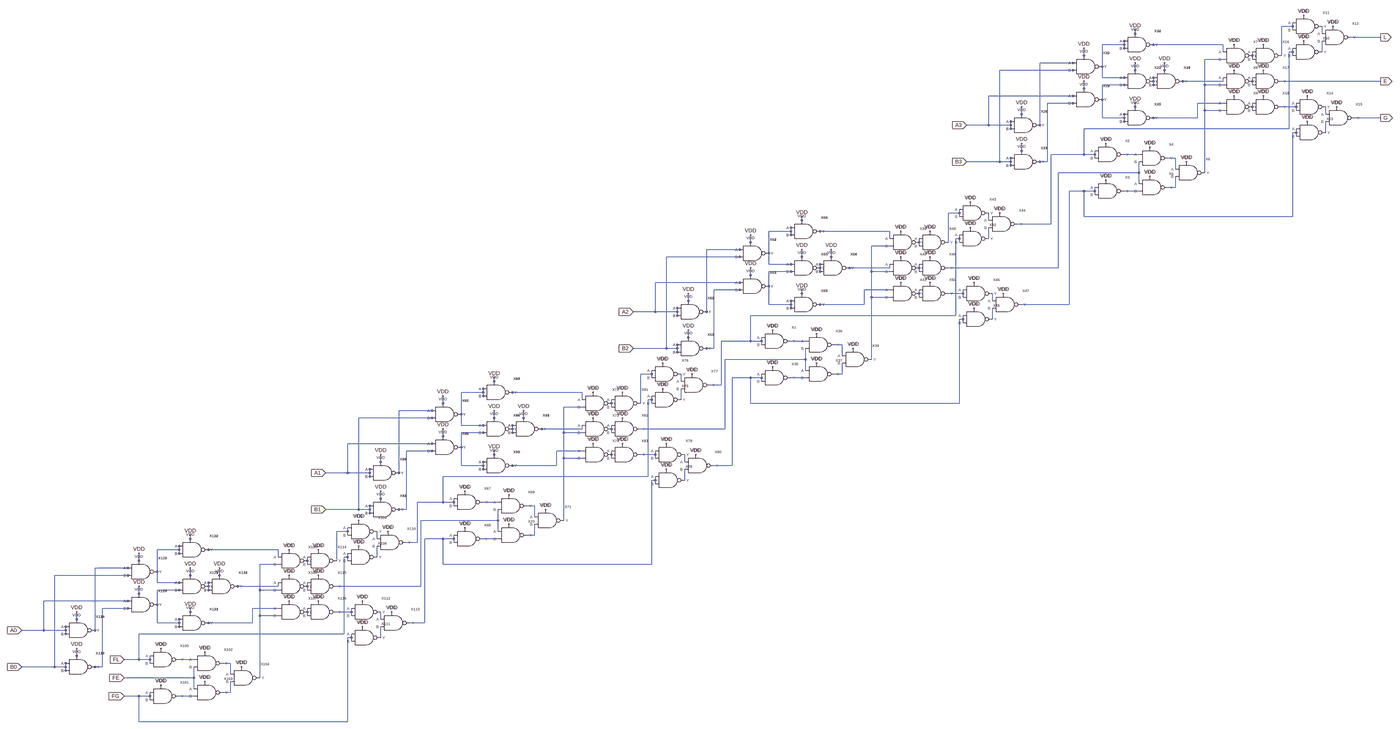
[diagram p0: schematic full-comparator4-all-in-one.asc, whole sheet]
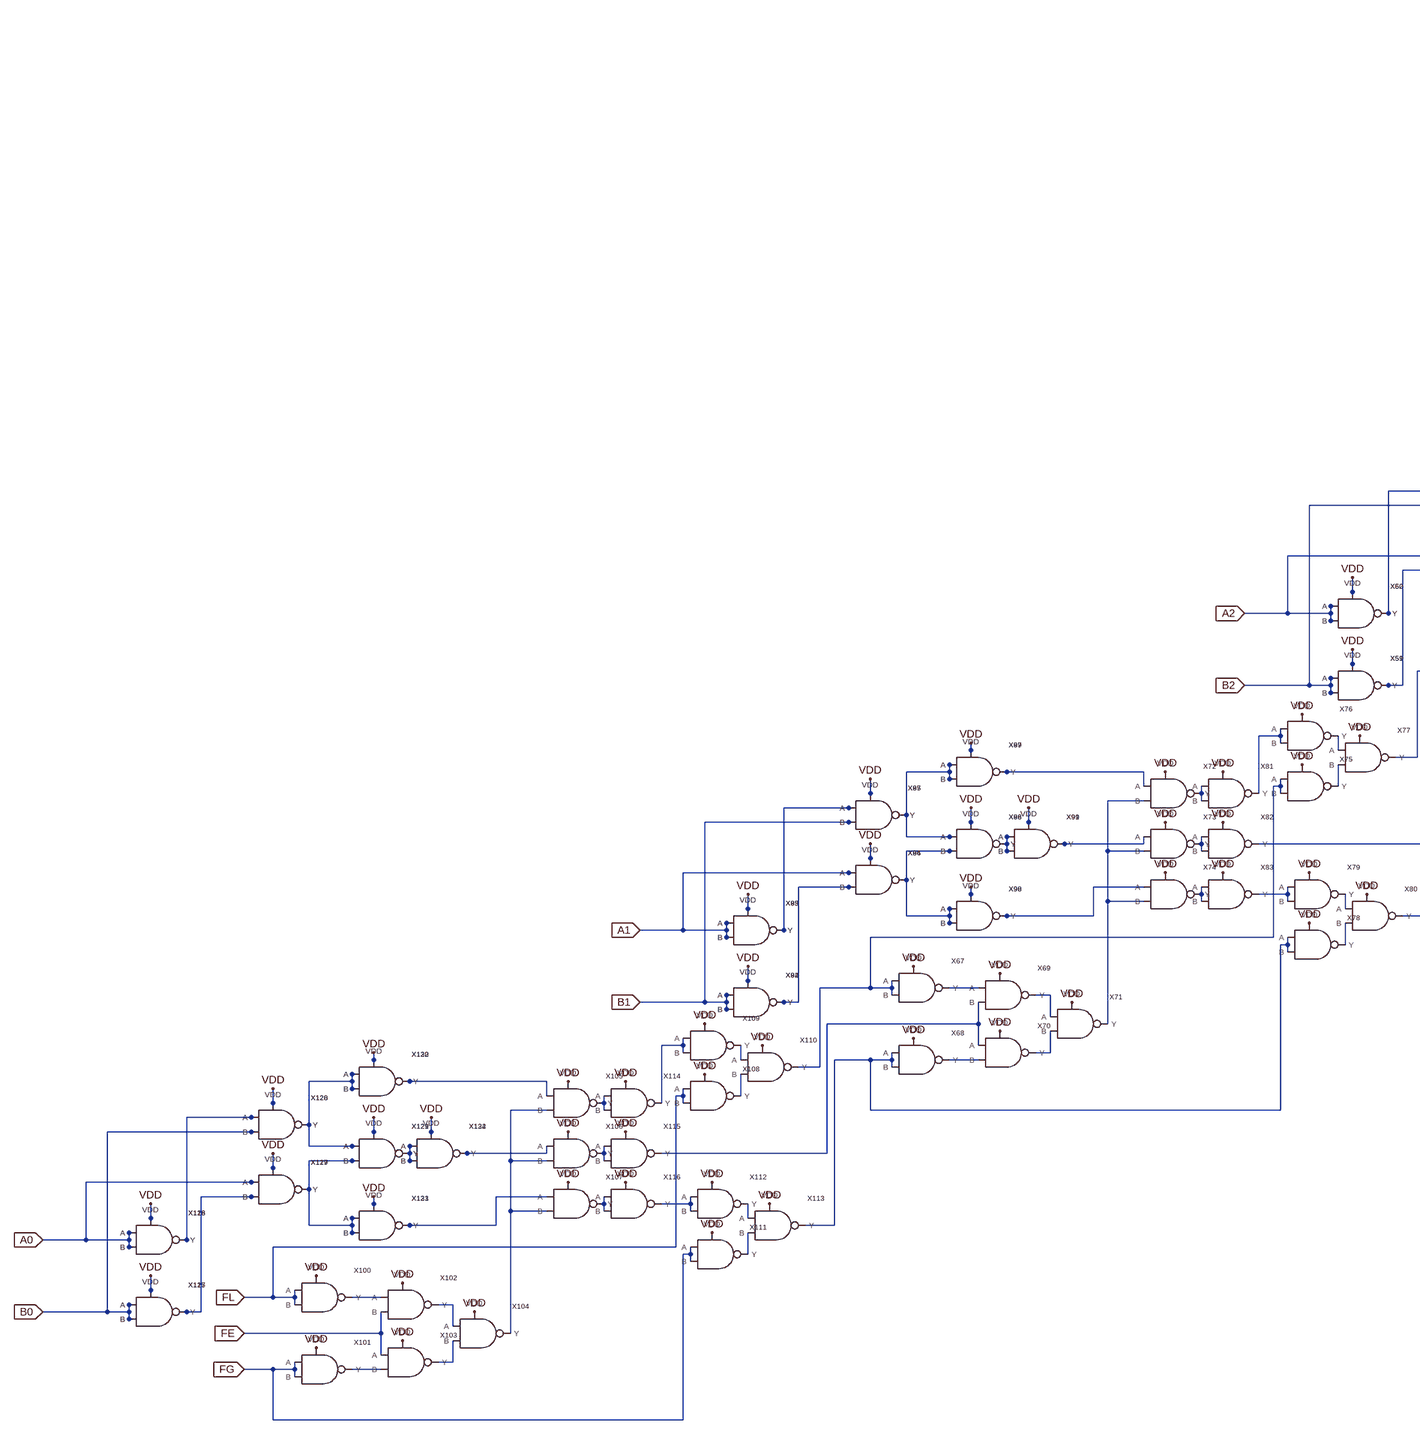
[diagram p1: schematic full-comparator4-all-in-one.asc, part, row 1 of 1, column 1 of 2]
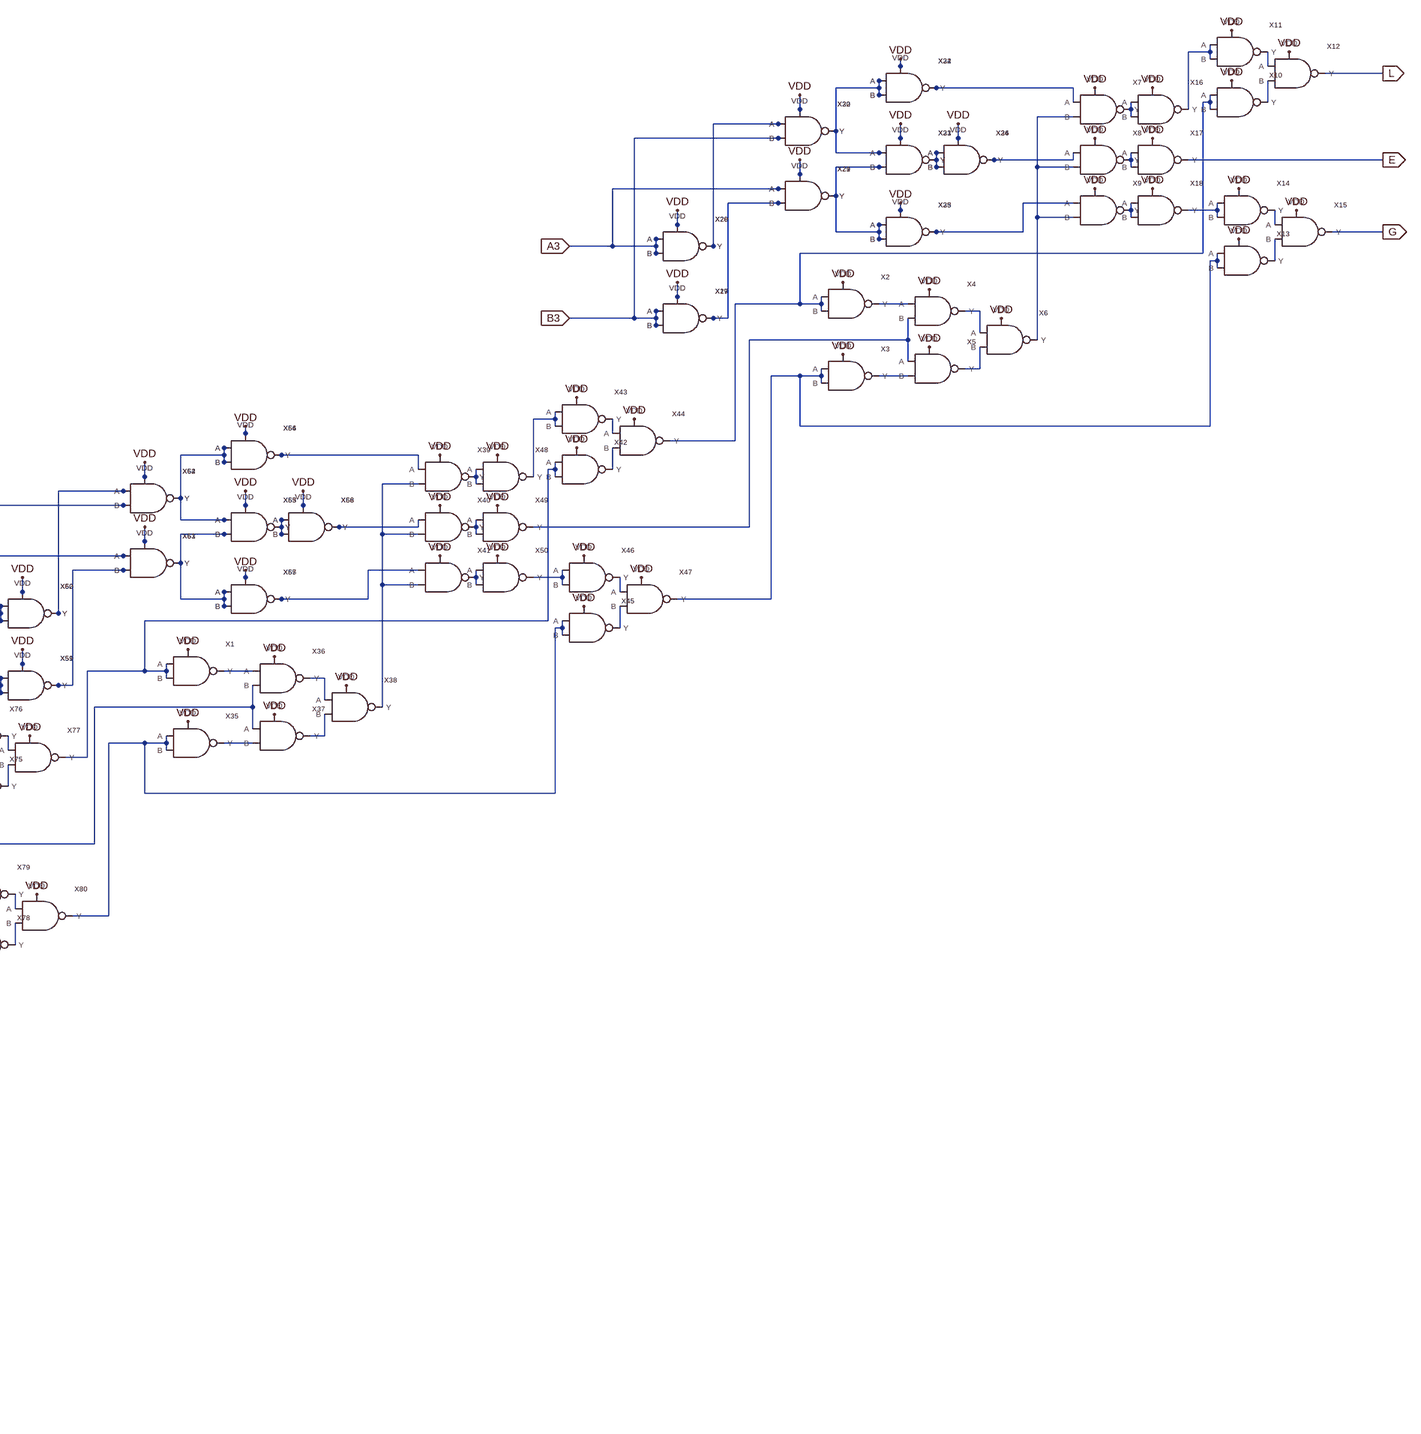
[diagram p2: schematic full-comparator4-all-in-one.asc, part, row 1 of 1, column 2 of 2]
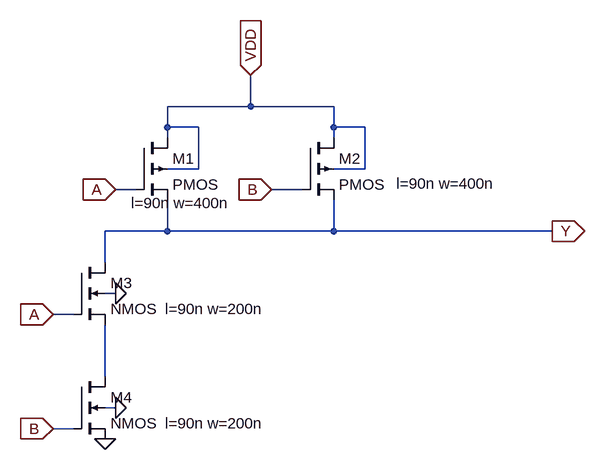
[diagram p3: sub-circuit nand.asc]
full-comparator4-all-in-one.asc, the LTspice schematic file:
Version 4
SHEET 1 1000 2564
WIRE 512 -480 512 -496
WIRE 512 -480 464 -480
WIRE 512 -464 512 -480
WIRE -176 -448 -176 -464
WIRE 640 -448 640 -480
WIRE 896 -432 768 -432
WIRE -224 -400 -224 -416
WIRE -224 -400 -320 -400
WIRE 208 -400 -96 -400
WIRE -224 -384 -224 -400
WIRE 208 -368 208 -400
WIRE 512 -368 512 -384
WIRE 512 -368 496 -368
WIRE 640 -368 640 -416
WIRE -400 -352 -400 -384
WIRE 336 -352 336 -368
WIRE 464 -352 464 -480
WIRE 512 -352 512 -368
WIRE 208 -336 128 -336
WIRE 336 -336 336 -352
WIRE -448 -320 -592 -320
WIRE -320 -304 -320 -400
WIRE -448 -288 -768 -288
WIRE -176 -288 -176 -320
WIRE -48 -288 -48 -320
WIRE -320 -256 -320 -304
WIRE -224 -256 -320 -256
WIRE -96 -240 -96 -256
WIRE 208 -240 208 -256
WIRE 208 -240 32 -240
WIRE 336 -240 336 -256
WIRE 896 -240 464 -240
WIRE -224 -224 -320 -224
WIRE -96 -224 -96 -240
WIRE 128 -224 128 -336
WIRE 208 -224 128 -224
WIRE 336 -224 336 -240
WIRE -400 -208 -400 -240
WIRE -448 -176 -816 -176
WIRE -320 -160 -320 -224
WIRE -448 -144 -560 -144
WIRE 208 -144 96 -144
WIRE -176 -128 -176 -144
WIRE 336 -128 336 -144
WIRE 528 -128 528 -144
WIRE 528 -128 464 -128
WIRE 128 -112 128 -224
WIRE 208 -112 128 -112
WIRE 336 -112 336 -128
WIRE 528 -112 528 -128
WIRE -672 -96 -672 -128
WIRE 656 -96 656 -128
WIRE -320 -80 -320 -160
WIRE -224 -80 -224 -96
WIRE -224 -80 -320 -80
WIRE 96 -80 96 -144
WIRE 96 -80 -96 -80
WIRE 896 -80 784 -80
WIRE -224 -64 -224 -80
WIRE -816 -48 -816 -176
WIRE -816 -48 -912 -48
WIRE -720 -48 -720 -64
WIRE -720 -48 -816 -48
WIRE -592 -48 -592 -320
WIRE -720 -32 -720 -48
WIRE 496 -32 496 -368
WIRE 496 -32 -400 -32
WIRE 528 -16 528 -32
WIRE 528 -16 512 -16
WIRE 656 -16 656 -64
WIRE 528 0 528 -16
WIRE -672 64 -672 32
WIRE -400 80 -400 -32
WIRE -400 80 -544 80
WIRE -352 80 -352 64
WIRE -352 80 -400 80
WIRE -160 80 -224 80
WIRE -352 96 -352 80
WIRE 0 96 -32 96
WIRE -768 112 -768 -288
WIRE -768 112 -912 112
WIRE -720 112 -720 96
WIRE -720 112 -768 112
WIRE -560 112 -560 -144
WIRE -560 112 -592 112
WIRE -720 128 -720 112
WIRE 0 144 0 96
WIRE -160 160 -160 112
WIRE -160 160 -512 160
WIRE 128 160 128 -112
WIRE -160 208 -160 160
WIRE 0 224 0 176
WIRE 0 224 -32 224
WIRE -400 240 -464 240
WIRE -352 240 -352 224
WIRE -352 240 -400 240
WIRE -160 240 -224 240
WIRE -352 256 -352 240
WIRE -944 336 -944 320
WIRE -944 336 -992 336
WIRE -944 352 -944 336
WIRE -400 352 -400 240
WIRE 512 352 512 -16
WIRE 512 352 -400 352
WIRE -1632 368 -1632 352
WIRE -816 368 -816 336
WIRE -544 384 -544 80
WIRE -544 384 -688 384
WIRE -1680 416 -1680 400
WIRE -1680 416 -1776 416
WIRE -1248 416 -1552 416
WIRE -1680 432 -1680 416
WIRE -1248 448 -1248 416
WIRE -944 448 -944 432
WIRE -944 448 -960 448
WIRE -816 448 -816 400
WIRE -1856 464 -1856 432
WIRE -1120 464 -1120 448
WIRE -992 464 -992 336
WIRE -944 464 -944 448
WIRE -1248 480 -1328 480
WIRE -1120 480 -1120 464
WIRE -1904 496 -2048 496
WIRE -1776 512 -1776 416
WIRE -1904 528 -2224 528
WIRE -1632 528 -1632 496
WIRE -1504 528 -1504 496
WIRE -1776 560 -1776 512
WIRE -1680 560 -1776 560
WIRE -1552 576 -1552 560
WIRE -1248 576 -1248 560
WIRE -1248 576 -1424 576
WIRE -1120 576 -1120 560
WIRE -512 576 -512 160
WIRE -512 576 -992 576
WIRE -1680 592 -1776 592
WIRE -1552 592 -1552 576
WIRE -1328 592 -1328 480
WIRE -1248 592 -1328 592
WIRE -1120 592 -1120 576
WIRE -1856 608 -1856 576
WIRE -1904 640 -2272 640
WIRE -1776 656 -1776 592
WIRE -1904 672 -2016 672
WIRE -1248 672 -1360 672
WIRE -1632 688 -1632 672
WIRE -1120 688 -1120 672
WIRE -928 688 -928 672
WIRE -928 688 -992 688
WIRE -1328 704 -1328 592
WIRE -1248 704 -1328 704
WIRE -1120 704 -1120 688
WIRE -928 704 -928 688
WIRE -2128 720 -2128 688
WIRE -800 720 -800 688
WIRE -1776 736 -1776 656
WIRE -1680 736 -1680 720
WIRE -1680 736 -1776 736
WIRE -1360 736 -1360 672
WIRE -1360 736 -1552 736
WIRE -464 736 -464 240
WIRE -464 736 -672 736
WIRE -1680 752 -1680 736
WIRE -2272 768 -2272 640
WIRE -2272 768 -2368 768
WIRE -2176 768 -2176 752
WIRE -2176 768 -2272 768
WIRE -2048 768 -2048 496
WIRE -2176 784 -2176 768
WIRE -960 784 -960 448
WIRE -960 784 -1856 784
WIRE -928 800 -928 784
WIRE -928 800 -944 800
WIRE -800 800 -800 752
WIRE -928 816 -928 800
WIRE -2128 880 -2128 848
WIRE -1856 896 -1856 784
WIRE -1856 896 -1984 896
WIRE -1808 896 -1808 880
WIRE -1808 896 -1856 896
WIRE -1616 896 -1680 896
WIRE -1808 912 -1808 896
WIRE -1456 912 -1488 912
WIRE -2224 928 -2224 528
WIRE -2224 928 -2368 928
WIRE -2176 928 -2176 912
WIRE -2176 928 -2224 928
WIRE -2016 928 -2016 672
WIRE -2016 928 -2048 928
WIRE -2176 944 -2176 928
WIRE -1456 960 -1456 912
WIRE -1616 976 -1616 928
WIRE -1616 976 -1968 976
WIRE -1328 976 -1328 704
WIRE -1616 1024 -1616 976
WIRE -2288 1040 -2288 1024
WIRE -2288 1040 -2336 1040
WIRE -1456 1040 -1456 992
WIRE -1456 1040 -1488 1040
WIRE -2288 1056 -2288 1040
WIRE -1856 1056 -1936 1056
WIRE -1808 1056 -1808 1040
WIRE -1808 1056 -1856 1056
WIRE -1616 1056 -1680 1056
WIRE -2976 1072 -2976 1056
WIRE -2160 1072 -2160 1040
WIRE -1808 1072 -1808 1056
WIRE -1984 1088 -1984 896
WIRE -1984 1088 -2032 1088
WIRE -3024 1120 -3024 1104
WIRE -3024 1120 -3120 1120
WIRE -2592 1120 -2896 1120
WIRE -3024 1136 -3024 1120
WIRE -2592 1152 -2592 1120
WIRE -2288 1152 -2288 1136
WIRE -2288 1152 -2304 1152
WIRE -2160 1152 -2160 1104
WIRE -3200 1168 -3200 1136
WIRE -2464 1168 -2464 1152
WIRE -2336 1168 -2336 1040
WIRE -2288 1168 -2288 1152
WIRE -1856 1168 -1856 1056
WIRE -944 1168 -944 800
WIRE -944 1168 -1856 1168
WIRE -2592 1184 -2672 1184
WIRE -2464 1184 -2464 1168
WIRE -3248 1200 -3392 1200
WIRE -3120 1216 -3120 1120
WIRE -3248 1232 -3568 1232
WIRE -2976 1232 -2976 1200
WIRE -2848 1232 -2848 1200
WIRE -3120 1264 -3120 1216
WIRE -3024 1264 -3120 1264
WIRE -2896 1280 -2896 1264
WIRE -2592 1280 -2592 1264
WIRE -2592 1280 -2768 1280
WIRE -2464 1280 -2464 1264
WIRE -1968 1280 -1968 976
WIRE -1968 1280 -2336 1280
WIRE -3024 1296 -3120 1296
WIRE -2896 1296 -2896 1280
WIRE -2672 1296 -2672 1184
WIRE -2592 1296 -2672 1296
WIRE -2464 1296 -2464 1280
WIRE -3200 1312 -3200 1280
WIRE -3248 1344 -3616 1344
WIRE -3120 1360 -3120 1296
WIRE -3248 1376 -3360 1376
WIRE -2592 1376 -2704 1376
WIRE -2976 1392 -2976 1376
WIRE -2464 1392 -2464 1376
WIRE -2272 1392 -2272 1376
WIRE -2272 1392 -2336 1392
WIRE -2672 1408 -2672 1296
WIRE -2592 1408 -2672 1408
WIRE -2464 1408 -2464 1392
WIRE -2272 1408 -2272 1392
WIRE -3472 1424 -3472 1392
WIRE -2144 1424 -2144 1392
WIRE -3120 1440 -3120 1360
WIRE -3024 1440 -3024 1424
WIRE -3024 1440 -3120 1440
WIRE -2704 1440 -2704 1376
WIRE -2704 1440 -2896 1440
WIRE -1936 1440 -1936 1056
WIRE -1936 1440 -2016 1440
WIRE -3024 1456 -3024 1440
WIRE -3616 1472 -3616 1344
WIRE -3616 1472 -3712 1472
WIRE -3520 1472 -3520 1456
WIRE -3520 1472 -3616 1472
WIRE -3392 1472 -3392 1200
WIRE -3520 1488 -3520 1472
WIRE -2304 1488 -2304 1152
WIRE -2304 1488 -3200 1488
WIRE -2272 1504 -2272 1488
WIRE -2272 1504 -2288 1504
WIRE -2144 1504 -2144 1456
WIRE -2272 1520 -2272 1504
WIRE -3472 1584 -3472 1552
WIRE -3200 1600 -3200 1488
WIRE -3200 1600 -3312 1600
WIRE -3152 1600 -3152 1584
WIRE -3152 1600 -3200 1600
WIRE -2960 1600 -3024 1600
WIRE -3152 1616 -3152 1600
WIRE -2800 1616 -2832 1616
WIRE -3568 1632 -3568 1232
WIRE -3568 1632 -3712 1632
WIRE -3520 1632 -3520 1616
WIRE -3520 1632 -3568 1632
WIRE -3360 1632 -3360 1376
WIRE -3360 1632 -3392 1632
WIRE -3520 1648 -3520 1632
WIRE -2800 1664 -2800 1616
WIRE -2960 1680 -2960 1632
WIRE -2960 1680 -3296 1680
WIRE -2672 1680 -2672 1408
WIRE -3616 1728 -3616 1712
WIRE -3616 1728 -3664 1728
WIRE -2960 1728 -2960 1680
WIRE -3616 1744 -3616 1728
WIRE -2800 1744 -2800 1696
WIRE -2800 1744 -2832 1744
WIRE -4304 1760 -4304 1744
WIRE -3488 1760 -3488 1728
WIRE -3200 1760 -3280 1760
WIRE -3152 1760 -3152 1744
WIRE -3152 1760 -3200 1760
WIRE -2960 1760 -3024 1760
WIRE -3312 1776 -3312 1600
WIRE -3312 1776 -3360 1776
WIRE -3152 1776 -3152 1760
WIRE -4352 1808 -4352 1792
WIRE -4352 1808 -4448 1808
WIRE -3920 1808 -4224 1808
WIRE -4352 1824 -4352 1808
WIRE -3920 1840 -3920 1808
WIRE -3616 1840 -3616 1824
WIRE -3616 1840 -3632 1840
WIRE -3488 1840 -3488 1792
WIRE -4528 1856 -4528 1824
WIRE -3792 1856 -3792 1840
WIRE -3664 1856 -3664 1728
WIRE -3616 1856 -3616 1840
WIRE -3920 1872 -4000 1872
WIRE -3792 1872 -3792 1856
WIRE -3200 1872 -3200 1760
WIRE -2288 1872 -2288 1504
WIRE -2288 1872 -3200 1872
WIRE -4576 1888 -4720 1888
WIRE -4448 1904 -4448 1808
WIRE -4576 1920 -4896 1920
WIRE -4304 1920 -4304 1888
WIRE -4176 1920 -4176 1888
WIRE -4448 1952 -4448 1904
WIRE -4352 1952 -4448 1952
WIRE -4224 1968 -4224 1952
WIRE -3920 1968 -3920 1952
WIRE -3920 1968 -4096 1968
WIRE -3792 1968 -3792 1952
WIRE -3296 1968 -3296 1680
WIRE -3296 1968 -3664 1968
WIRE -4352 1984 -4448 1984
WIRE -4224 1984 -4224 1968
WIRE -4000 1984 -4000 1872
WIRE -3920 1984 -4000 1984
WIRE -3792 1984 -3792 1968
WIRE -4528 2000 -4528 1968
WIRE -4576 2032 -4944 2032
WIRE -4448 2048 -4448 1984
WIRE -4576 2064 -4688 2064
WIRE -3920 2064 -4032 2064
WIRE -4304 2080 -4304 2064
WIRE -3792 2080 -3792 2064
WIRE -3600 2080 -3600 2064
WIRE -3600 2080 -3664 2080
WIRE -4000 2096 -4000 1984
WIRE -3920 2096 -4000 2096
WIRE -3792 2096 -3792 2080
WIRE -3600 2096 -3600 2080
WIRE -4800 2112 -4800 2080
WIRE -3472 2112 -3472 2080
WIRE -4448 2128 -4448 2048
WIRE -4352 2128 -4352 2112
WIRE -4352 2128 -4448 2128
WIRE -4032 2128 -4032 2064
WIRE -4032 2128 -4224 2128
WIRE -3280 2128 -3280 1760
WIRE -3280 2128 -3344 2128
WIRE -4352 2144 -4352 2128
WIRE -4944 2160 -4944 2032
WIRE -4944 2160 -5040 2160
WIRE -4848 2160 -4848 2144
WIRE -4848 2160 -4944 2160
WIRE -4720 2160 -4720 1888
WIRE -4848 2176 -4848 2160
WIRE -3632 2176 -3632 1840
WIRE -3632 2176 -4528 2176
WIRE -3600 2192 -3600 2176
WIRE -3600 2192 -3616 2192
WIRE -3472 2192 -3472 2144
WIRE -3600 2208 -3600 2192
WIRE -4800 2272 -4800 2240
WIRE -4528 2288 -4528 2176
WIRE -4528 2288 -4592 2288
WIRE -4480 2288 -4480 2272
WIRE -4480 2288 -4528 2288
WIRE -4288 2288 -4352 2288
WIRE -4480 2304 -4480 2288
WIRE -4128 2304 -4160 2304
WIRE -4896 2320 -4896 1920
WIRE -4896 2320 -5040 2320
WIRE -4848 2320 -4848 2304
WIRE -4848 2320 -4896 2320
WIRE -4688 2320 -4688 2064
WIRE -4688 2320 -4720 2320
WIRE -4848 2336 -4848 2320
WIRE -4128 2352 -4128 2304
WIRE -4288 2368 -4288 2320
WIRE -4288 2368 -4592 2368
WIRE -4000 2368 -4000 2096
WIRE -4288 2416 -4288 2368
WIRE -4128 2432 -4128 2384
WIRE -4128 2432 -4160 2432
WIRE -4528 2448 -4592 2448
WIRE -4480 2448 -4480 2432
WIRE -4480 2448 -4528 2448
WIRE -4288 2448 -4352 2448
WIRE -4480 2464 -4480 2448
WIRE -4528 2560 -4528 2448
WIRE -3616 2560 -3616 2192
WIRE -3616 2560 -4528 2560
FLAG 896 -240 E
IOPIN 896 -240 Out
FLAG 896 -432 L
IOPIN 896 -432 Out
FLAG 896 -80 G
IOPIN 896 -80 Out
FLAG -304 32 VDD
FLAG -112 48 VDD
FLAG 48 112 VDD
FLAG -112 176 VDD
FLAG -304 192 VDD
FLAG 256 -176 VDD
FLAG 384 -176 VDD
FLAG 256 -288 VDD
FLAG 384 -288 VDD
FLAG 256 -400 VDD
FLAG 384 -400 VDD
FLAG 560 -528 VDD
FLAG 560 -416 VDD
FLAG 576 -176 VDD
FLAG 576 -64 VDD
FLAG 704 -128 VDD
FLAG 688 -480 VDD
FLAG -912 112 B3
IOPIN -912 112 In
FLAG -912 -48 A3
IOPIN -912 -48 In
FLAG -672 32 VDD
FLAG -672 -128 VDD
FLAG -400 -384 VDD
FLAG -400 -240 VDD
FLAG -176 -320 VDD
FLAG -176 -144 VDD
FLAG -176 -464 VDD
FLAG -48 -320 VDD
FLAG -1760 848 VDD
FLAG -1568 864 VDD
FLAG -1408 928 VDD
FLAG -1568 992 VDD
FLAG -1760 1008 VDD
FLAG -1200 640 VDD
FLAG -1072 640 VDD
FLAG -1200 528 VDD
FLAG -1072 528 VDD
FLAG -1200 416 VDD
FLAG -1072 416 VDD
FLAG -896 288 VDD
FLAG -896 400 VDD
FLAG -880 640 VDD
FLAG -880 752 VDD
FLAG -752 688 VDD
FLAG -768 336 VDD
FLAG -2368 928 B2
IOPIN -2368 928 In
FLAG -2368 768 A2
IOPIN -2368 768 In
FLAG -2128 848 VDD
FLAG -2128 688 VDD
FLAG -1856 432 VDD
FLAG -1856 576 VDD
FLAG -1632 496 VDD
FLAG -1632 672 VDD
FLAG -1632 352 VDD
FLAG -1504 496 VDD
FLAG -3104 1552 VDD
FLAG -2912 1568 VDD
FLAG -2752 1632 VDD
FLAG -2912 1696 VDD
FLAG -3104 1712 VDD
FLAG -2544 1344 VDD
FLAG -2416 1344 VDD
FLAG -2544 1232 VDD
FLAG -2416 1232 VDD
FLAG -2544 1120 VDD
FLAG -2416 1120 VDD
FLAG -2240 992 VDD
FLAG -2240 1104 VDD
FLAG -2224 1344 VDD
FLAG -2224 1456 VDD
FLAG -2096 1392 VDD
FLAG -2112 1040 VDD
FLAG -3712 1632 B1
IOPIN -3712 1632 In
FLAG -3712 1472 A1
IOPIN -3712 1472 In
FLAG -3472 1552 VDD
FLAG -3472 1392 VDD
FLAG -3200 1136 VDD
FLAG -3200 1280 VDD
FLAG -2976 1200 VDD
FLAG -2976 1376 VDD
FLAG -2976 1056 VDD
FLAG -2848 1200 VDD
FLAG -4592 2288 FL
IOPIN -4592 2288 In
FLAG -4592 2368 FE
IOPIN -4592 2368 In
FLAG -4592 2448 FG
IOPIN -4592 2448 In
FLAG -4432 2240 VDD
FLAG -4240 2256 VDD
FLAG -4080 2320 VDD
FLAG -4240 2384 VDD
FLAG -4432 2400 VDD
FLAG -3872 2032 VDD
FLAG -3744 2032 VDD
FLAG -3872 1920 VDD
FLAG -3744 1920 VDD
FLAG -3872 1808 VDD
FLAG -3744 1808 VDD
FLAG -3568 1680 VDD
FLAG -3568 1792 VDD
FLAG -3552 2032 VDD
FLAG -3552 2144 VDD
FLAG -3424 2080 VDD
FLAG -3440 1728 VDD
FLAG -5040 2320 B0
IOPIN -5040 2320 In
FLAG -5040 2160 A0
IOPIN -5040 2160 In
FLAG -4800 2240 VDD
FLAG -4800 2080 VDD
FLAG -4528 1824 VDD
FLAG -4528 1968 VDD
FLAG -4304 1888 VDD
FLAG -4304 2064 VDD
FLAG -4304 1744 VDD
FLAG -4176 1888 VDD
SYMBOL nand -304 80 R0
SYMATTR InstName X2
SYMBOL nand -304 240 R0
SYMATTR InstName X3
SYMBOL nand -112 96 R0
SYMATTR InstName X4
SYMBOL nand -112 224 R0
SYMATTR InstName X5
SYMBOL nand 48 160 R0
SYMATTR InstName X6
SYMBOL nand 256 -352 R0
SYMATTR InstName X7
SYMBOL nand 256 -240 R0
SYMATTR InstName X8
SYMBOL nand 256 -128 R0
SYMATTR InstName X9
SYMBOL nand 560 -368 R0
SYMATTR InstName X10
SYMBOL nand 560 -480 R0
SYMATTR InstName X11
SYMBOL nand 688 -432 R0
SYMATTR InstName X12
SYMBOL nand 576 -16 R0
SYMATTR InstName X13
SYMBOL nand 576 -128 R0
SYMATTR InstName X14
SYMBOL nand 704 -80 R0
SYMATTR InstName X15
SYMBOL nand 384 -352 R0
SYMATTR InstName X16
SYMBOL nand 384 -240 R0
SYMATTR InstName X17
SYMBOL nand 384 -128 R0
SYMATTR InstName X18
SYMBOL nand -672 112 R0
SYMATTR InstName X19
SYMBOL nand -672 -48 R0
SYMATTR InstName X20
SYMBOL nand -400 -160 R0
SYMATTR InstName X21
SYMBOL nand -400 -304 R0
SYMATTR InstName X22
SYMBOL nand -176 -240 R0
SYMATTR InstName X23
SYMBOL nand -176 -400 R0
SYMATTR InstName X24
SYMBOL nand -176 -80 R0
SYMATTR InstName X25
SYMBOL nand -48 -240 R0
SYMATTR InstName X26
SYMBOL nand -672 112 R0
SYMATTR InstName X27
SYMBOL nand -672 -48 R0
SYMATTR InstName X28
SYMBOL nand -400 -160 R0
SYMATTR InstName X29
SYMBOL nand -400 -304 R0
SYMATTR InstName X30
SYMBOL nand -176 -240 R0
SYMATTR InstName X31
SYMBOL nand -176 -400 R0
SYMATTR InstName X32
SYMBOL nand -176 -80 R0
SYMATTR InstName X33
SYMBOL nand -48 -240 R0
SYMATTR InstName X34
SYMBOL nand -1760 896 R0
SYMATTR InstName X1
SYMBOL nand -1760 1056 R0
SYMATTR InstName X35
SYMBOL nand -1568 912 R0
SYMATTR InstName X36
SYMBOL nand -1568 1040 R0
SYMATTR InstName X37
SYMBOL nand -1408 976 R0
SYMATTR InstName X38
SYMBOL nand -1200 464 R0
SYMATTR InstName X39
SYMBOL nand -1200 576 R0
SYMATTR InstName X40
SYMBOL nand -1200 688 R0
SYMATTR InstName X41
SYMBOL nand -896 448 R0
SYMATTR InstName X42
SYMBOL nand -896 336 R0
SYMATTR InstName X43
SYMBOL nand -768 384 R0
SYMATTR InstName X44
SYMBOL nand -880 800 R0
SYMATTR InstName X45
SYMBOL nand -880 688 R0
SYMATTR InstName X46
SYMBOL nand -752 736 R0
SYMATTR InstName X47
SYMBOL nand -1072 464 R0
SYMATTR InstName X48
SYMBOL nand -1072 576 R0
SYMATTR InstName X49
SYMBOL nand -1072 688 R0
SYMATTR InstName X50
SYMBOL nand -2128 928 R0
SYMATTR InstName X51
SYMBOL nand -2128 768 R0
SYMATTR InstName X52
SYMBOL nand -1856 656 R0
SYMATTR InstName X53
SYMBOL nand -1856 512 R0
SYMATTR InstName X54
SYMBOL nand -1632 576 R0
SYMATTR InstName X55
SYMBOL nand -1632 416 R0
SYMATTR InstName X56
SYMBOL nand -1632 736 R0
SYMATTR InstName X57
SYMBOL nand -1504 576 R0
SYMATTR InstName X58
SYMBOL nand -2128 928 R0
SYMATTR InstName X59
SYMBOL nand -2128 768 R0
SYMATTR InstName X60
SYMBOL nand -1856 656 R0
SYMATTR InstName X61
SYMBOL nand -1856 512 R0
SYMATTR InstName X62
SYMBOL nand -1632 576 R0
SYMATTR InstName X63
SYMBOL nand -1632 416 R0
SYMATTR InstName X64
SYMBOL nand -1632 736 R0
SYMATTR InstName X65
SYMBOL nand -1504 576 R0
SYMATTR InstName X66
SYMBOL nand -3104 1600 R0
SYMATTR InstName X67
SYMBOL nand -3104 1760 R0
SYMATTR InstName X68
SYMBOL nand -2912 1616 R0
SYMATTR InstName X69
SYMBOL nand -2912 1744 R0
SYMATTR InstName X70
SYMBOL nand -2752 1680 R0
SYMATTR InstName X71
SYMBOL nand -2544 1168 R0
SYMATTR InstName X72
SYMBOL nand -2544 1280 R0
SYMATTR InstName X73
SYMBOL nand -2544 1392 R0
SYMATTR InstName X74
SYMBOL nand -2240 1152 R0
SYMATTR InstName X75
SYMBOL nand -2240 1040 R0
SYMATTR InstName X76
SYMBOL nand -2112 1088 R0
SYMATTR InstName X77
SYMBOL nand -2224 1504 R0
SYMATTR InstName X78
SYMBOL nand -2224 1392 R0
SYMATTR InstName X79
SYMBOL nand -2096 1440 R0
SYMATTR InstName X80
SYMBOL nand -2416 1168 R0
SYMATTR InstName X81
SYMBOL nand -2416 1280 R0
SYMATTR InstName X82
SYMBOL nand -2416 1392 R0
SYMATTR InstName X83
SYMBOL nand -3472 1632 R0
SYMATTR InstName X84
SYMBOL nand -3472 1472 R0
SYMATTR InstName X85
SYMBOL nand -3200 1360 R0
SYMATTR InstName X86
SYMBOL nand -3200 1216 R0
SYMATTR InstName X87
SYMBOL nand -2976 1280 R0
SYMATTR InstName X88
SYMBOL nand -2976 1120 R0
SYMATTR InstName X89
SYMBOL nand -2976 1440 R0
SYMATTR InstName X90
SYMBOL nand -2848 1280 R0
SYMATTR InstName X91
SYMBOL nand -3472 1632 R0
SYMATTR InstName X92
SYMBOL nand -3472 1472 R0
SYMATTR InstName X93
SYMBOL nand -3200 1360 R0
SYMATTR InstName X94
SYMBOL nand -3200 1216 R0
SYMATTR InstName X95
SYMBOL nand -2976 1280 R0
SYMATTR InstName X96
SYMBOL nand -2976 1120 R0
SYMATTR InstName X97
SYMBOL nand -2976 1440 R0
SYMATTR InstName X98
SYMBOL nand -2848 1280 R0
SYMATTR InstName X99
SYMBOL nand -4432 2288 R0
SYMATTR InstName X100
SYMBOL nand -4432 2448 R0
SYMATTR InstName X101
SYMBOL nand -4240 2304 R0
SYMATTR InstName X102
SYMBOL nand -4240 2432 R0
SYMATTR InstName X103
SYMBOL nand -4080 2368 R0
SYMATTR InstName X104
SYMBOL nand -3872 1856 R0
SYMATTR InstName X105
SYMBOL nand -3872 1968 R0
SYMATTR InstName X106
SYMBOL nand -3872 2080 R0
SYMATTR InstName X107
SYMBOL nand -3568 1840 R0
SYMATTR InstName X108
SYMBOL nand -3568 1728 R0
SYMATTR InstName X109
SYMBOL nand -3440 1776 R0
SYMATTR InstName X110
SYMBOL nand -3552 2192 R0
SYMATTR InstName X111
SYMBOL nand -3552 2080 R0
SYMATTR InstName X112
SYMBOL nand -3424 2128 R0
SYMATTR InstName X113
SYMBOL nand -3744 1856 R0
SYMATTR InstName X114
SYMBOL nand -3744 1968 R0
SYMATTR InstName X115
SYMBOL nand -3744 2080 R0
SYMATTR InstName X116
SYMBOL nand -4800 2320 R0
SYMATTR InstName X117
SYMBOL nand -4800 2160 R0
SYMATTR InstName X118
SYMBOL nand -4528 2048 R0
SYMATTR InstName X119
SYMBOL nand -4528 1904 R0
SYMATTR InstName X120
SYMBOL nand -4304 1968 R0
SYMATTR InstName X121
SYMBOL nand -4304 1808 R0
SYMATTR InstName X122
SYMBOL nand -4304 2128 R0
SYMATTR InstName X123
SYMBOL nand -4176 1968 R0
SYMATTR InstName X124
SYMBOL nand -4800 2320 R0
SYMATTR InstName X125
SYMBOL nand -4800 2160 R0
SYMATTR InstName X126
SYMBOL nand -4528 2048 R0
SYMATTR InstName X127
SYMBOL nand -4528 1904 R0
SYMATTR InstName X128
SYMBOL nand -4304 1968 R0
SYMATTR InstName X129
SYMBOL nand -4304 1808 R0
SYMATTR InstName X130
SYMBOL nand -4304 2128 R0
SYMATTR InstName X131
SYMBOL nand -4176 1968 R0
SYMATTR InstName X132

nand.asc, the sub-circuit schematic file:
Version 4
SHEET 1 1436 680
WIRE 896 -896 896 -944
WIRE 896 -896 768 -896
WIRE 1024 -896 896 -896
WIRE 768 -864 768 -896
WIRE 816 -864 768 -864
WIRE 1024 -864 1024 -896
WIRE 1072 -864 1024 -864
WIRE 768 -848 768 -864
WIRE 1024 -848 1024 -864
WIRE 816 -800 816 -864
WIRE 816 -800 768 -800
WIRE 1072 -800 1072 -864
WIRE 1072 -800 1024 -800
WIRE 720 -768 688 -768
WIRE 976 -768 928 -768
WIRE 768 -704 768 -752
WIRE 768 -704 672 -704
WIRE 1024 -704 1024 -752
WIRE 1024 -704 768 -704
WIRE 1360 -704 1024 -704
WIRE 672 -656 672 -704
WIRE 688 -608 672 -608
WIRE 624 -576 592 -576
WIRE 672 -480 672 -560
WIRE 688 -432 672 -432
WIRE 624 -400 592 -400
FLAG 688 -768 A
IOPIN 688 -768 In
FLAG 592 -576 A
IOPIN 592 -576 In
FLAG 1360 -704 Y
IOPIN 1360 -704 Out
FLAG 896 -944 VDD
IOPIN 896 -944 In
FLAG 928 -768 B
IOPIN 928 -768 In
FLAG 592 -400 B
IOPIN 592 -400 In
FLAG 688 -608 0
FLAG 688 -432 0
FLAG 672 -384 0
SYMBOL pmos4 720 -848 R0
WINDOW 123 -8 101 Left 2
SYMATTR InstName M1
SYMATTR Value2 l=90n w=400n
SYMBOL pmos4 976 -848 R0
WINDOW 123 144 71 Left 2
SYMATTR InstName M2
SYMATTR Value2 l=90n w=400n
SYMBOL nmos4 624 -656 R0
WINDOW 123 140 72 Left 2
SYMATTR InstName M3
SYMATTR Value2 l=90n w=200n
SYMBOL nmos4 624 -480 R0
WINDOW 123 140 72 Left 2
SYMATTR InstName M4
SYMATTR Value2 l=90n w=200n

The netlist it stands for:
* full-comparator4-all-in-one.asc
XX2 N005 N005 VDD N021 nand
XX3 N019 N019 VDD N025 nand
XX4 N021 N023 VDD N022 nand
XX5 N023 N025 VDD N024 nand
XX6 N022 N024 VDD N008 nand
XX7 N004 N008 VDD N007 nand
XX8 N011 N008 VDD N012 nand
XX9 N015 N008 VDD N016 nand
XX10 N005 N005 VDD N006 nand
XX11 N001 N001 VDD N002 nand
XX12 N002 N006 VDD L nand
XX13 N019 N019 VDD N020 nand
XX14 N017 N017 VDD N018 nand
XX15 N018 N020 VDD G nand
XX16 N007 N007 VDD N001 nand
XX17 N012 N012 VDD E nand
XX18 N016 N016 VDD N017 nand
XX19 B3 B3 VDD N014 nand
XX20 A3 A3 VDD N009 nand
XX21 A3 N014 VDD N013 nand
XX22 N009 B3 VDD N003 nand
XX23 N003 N013 VDD N010 nand
XX24 N003 N003 VDD N004 nand
XX25 N013 N013 VDD N015 nand
XX26 N010 N010 VDD N011 nand
XX27 B3 B3 VDD N014 nand
XX28 A3 A3 VDD N009 nand
XX29 A3 N014 VDD N013 nand
XX30 N009 B3 VDD N003 nand
XX31 N003 N013 VDD N010 nand
XX32 N003 N003 VDD N004 nand
XX33 N013 N013 VDD N015 nand
XX34 N010 N010 VDD N011 nand
XX1 N030 N030 VDD N046 nand
XX35 N044 N044 VDD N051 nand
XX36 N046 N048 VDD N047 nand
XX37 N048 N051 VDD N050 nand
XX38 N047 N050 VDD N033 nand
XX39 N029 N033 VDD N032 nand
XX40 N036 N033 VDD N037 nand
XX41 N040 N033 VDD N041 nand
XX42 N030 N030 VDD N031 nand
XX43 N026 N026 VDD N027 nand
XX44 N027 N031 VDD N005 nand
XX45 N044 N044 VDD N045 nand
XX46 N042 N042 VDD N043 nand
XX47 N043 N045 VDD N019 nand
XX48 N032 N032 VDD N026 nand
XX49 N037 N037 VDD N023 nand
XX50 N041 N041 VDD N042 nand
XX51 B2 B2 VDD N039 nand
XX52 A2 A2 VDD N034 nand
XX53 A2 N039 VDD N038 nand
XX54 N034 B2 VDD N028 nand
XX55 N028 N038 VDD N035 nand
XX56 N028 N028 VDD N029 nand
XX57 N038 N038 VDD N040 nand
XX58 N035 N035 VDD N036 nand
XX59 B2 B2 VDD N039 nand
XX60 A2 A2 VDD N034 nand
XX61 A2 N039 VDD N038 nand
XX62 N034 B2 VDD N028 nand
XX63 N028 N038 VDD N035 nand
XX64 N028 N028 VDD N029 nand
XX65 N038 N038 VDD N040 nand
XX66 N035 N035 VDD N036 nand
XX67 N055 N055 VDD N071 nand
XX68 N069 N069 VDD N077 nand
XX69 N071 N073 VDD N072 nand
XX70 N073 N077 VDD N075 nand
XX71 N072 N075 VDD N058 nand
XX72 N054 N058 VDD N057 nand
XX73 N061 N058 VDD N062 nand
XX74 N065 N058 VDD N066 nand
XX75 N055 N055 VDD N056 nand
XX76 N049 N049 VDD N052 nand
XX77 N052 N056 VDD N030 nand
XX78 N069 N069 VDD N070 nand
XX79 N067 N067 VDD N068 nand
XX80 N068 N070 VDD N044 nand
XX81 N057 N057 VDD N049 nand
XX82 N062 N062 VDD N048 nand
XX83 N066 N066 VDD N067 nand
XX84 B1 B1 VDD N064 nand
XX85 A1 A1 VDD N059 nand
XX86 A1 N064 VDD N063 nand
XX87 N059 B1 VDD N053 nand
XX88 N053 N063 VDD N060 nand
XX89 N053 N053 VDD N054 nand
XX90 N063 N063 VDD N065 nand
XX91 N060 N060 VDD N061 nand
XX92 B1 B1 VDD N064 nand
XX93 A1 A1 VDD N059 nand
XX94 A1 N064 VDD N063 nand
XX95 N059 B1 VDD N053 nand
XX96 N053 N063 VDD N060 nand
XX97 N053 N053 VDD N054 nand
XX98 N063 N063 VDD N065 nand
XX99 N060 N060 VDD N061 nand
XX100 FL FL VDD N094 nand
XX101 FG FG VDD N097 nand
XX102 N094 FE VDD N095 nand
XX103 FE N097 VDD N096 nand
XX104 N095 N096 VDD N082 nand
XX105 N079 N082 VDD N081 nand
XX106 N085 N082 VDD N086 nand
XX107 N089 N082 VDD N090 nand
XX108 FL FL VDD N080 nand
XX109 N074 N074 VDD N076 nand
XX110 N076 N080 VDD N055 nand
XX111 FG FG VDD N093 nand
XX112 N091 N091 VDD N092 nand
XX113 N092 N093 VDD N069 nand
XX114 N081 N081 VDD N074 nand
XX115 N086 N086 VDD N073 nand
XX116 N090 N090 VDD N091 nand
XX117 B0 B0 VDD N088 nand
XX118 A0 A0 VDD N083 nand
XX119 A0 N088 VDD N087 nand
XX120 N083 B0 VDD N078 nand
XX121 N078 N087 VDD N084 nand
XX122 N078 N078 VDD N079 nand
XX123 N087 N087 VDD N089 nand
XX124 N084 N084 VDD N085 nand
XX125 B0 B0 VDD N088 nand
XX126 A0 A0 VDD N083 nand
XX127 A0 N088 VDD N087 nand
XX128 N083 B0 VDD N078 nand
XX129 N078 N087 VDD N084 nand
XX130 N078 N078 VDD N079 nand
XX131 N087 N087 VDD N089 nand
XX132 N084 N084 VDD N085 nand

* block symbol definitions
.subckt nand A B VDD Y
M1 VDD A Y VDD PMOS l=90n w=400n
M2 VDD B Y VDD PMOS l=90n w=400n
M3 Y A N001 0 NMOS l=90n w=200n
M4 N001 B 0 0 NMOS l=90n w=200n
.ends nand

.model NMOS NMOS
.model PMOS PMOS
.lib standard.mos
.backanno
.end